# Altium schematic sheet LX1_v1.SchDoc: LX-1
size A4; Organization: Carbon Video Systems; Address1: 1265 Powell Street; Address2: Vancouver, BC; Address3: Canada; Revision: 0.1; SheetNumber: 1
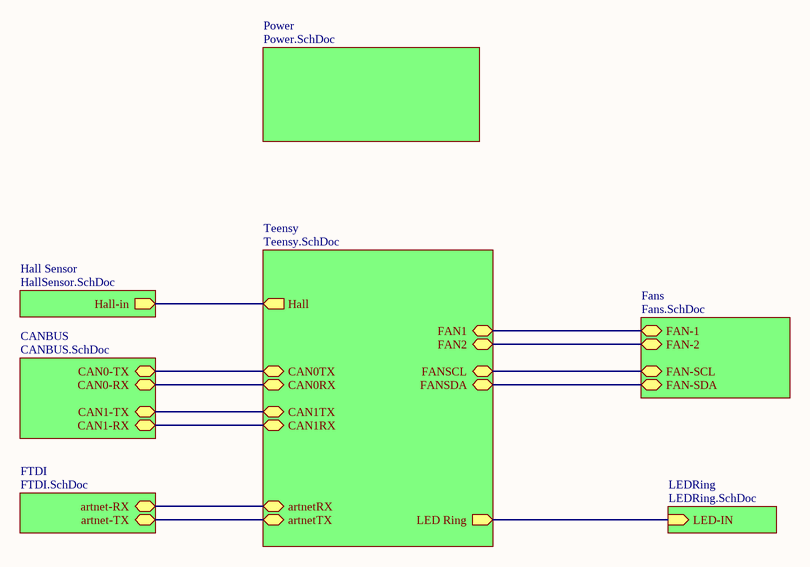
[diagram p0: LX1_v1.SchDoc]

## Sub-sheets
CANBUS = CANBUS.SchDoc: CAN0-TX, CAN0-RX, CAN1-TX, CAN1-RX
Fans = Fans.SchDoc: FAN-1, FAN-2, FAN-SCL, FAN-SDA
FTDI = FTDI.SchDoc: artnet-RX, artnet-TX
Hall Sensor = HallSensor.SchDoc: Hall-in
LEDRing = LEDRing.SchDoc: LED-IN (in)
Power = Power.SchDoc: no entries
Teensy = Teensy.SchDoc: LED Ring (out), FAN1, FAN2, FANSDA, FANSCL, artnetTX, artnetRX, Hall, CAN0TX, CAN0RX, CAN1TX, CAN1RX

## Nets
(unnamed): sheet Teensy/LED Ring, sheet LEDRing/LED-IN
(unnamed): sheet Teensy/FAN1, sheet Fans/FAN-1
(unnamed): sheet Teensy/FAN2, sheet Fans/FAN-2
(unnamed): sheet Teensy/FANSDA, sheet Fans/FAN-SDA
(unnamed): sheet Teensy/FANSCL, sheet Fans/FAN-SCL
(unnamed): sheet Teensy/artnetTX, sheet FTDI/artnet-TX
(unnamed): sheet Teensy/artnetRX, sheet FTDI/artnet-RX
(unnamed): sheet Teensy/Hall, sheet Hall Sensor/Hall-in
(unnamed): sheet Teensy/CAN0TX, sheet CANBUS/CAN0-TX
(unnamed): sheet Teensy/CAN0RX, sheet CANBUS/CAN0-RX
(unnamed): sheet Teensy/CAN1TX, sheet CANBUS/CAN1-TX
(unnamed): sheet Teensy/CAN1RX, sheet CANBUS/CAN1-RX

## Notes on the sheet
- Title
- Size:
- Date:
- A4
- Number:
- Time:
- Revision:
- Sheet
- of
- File: